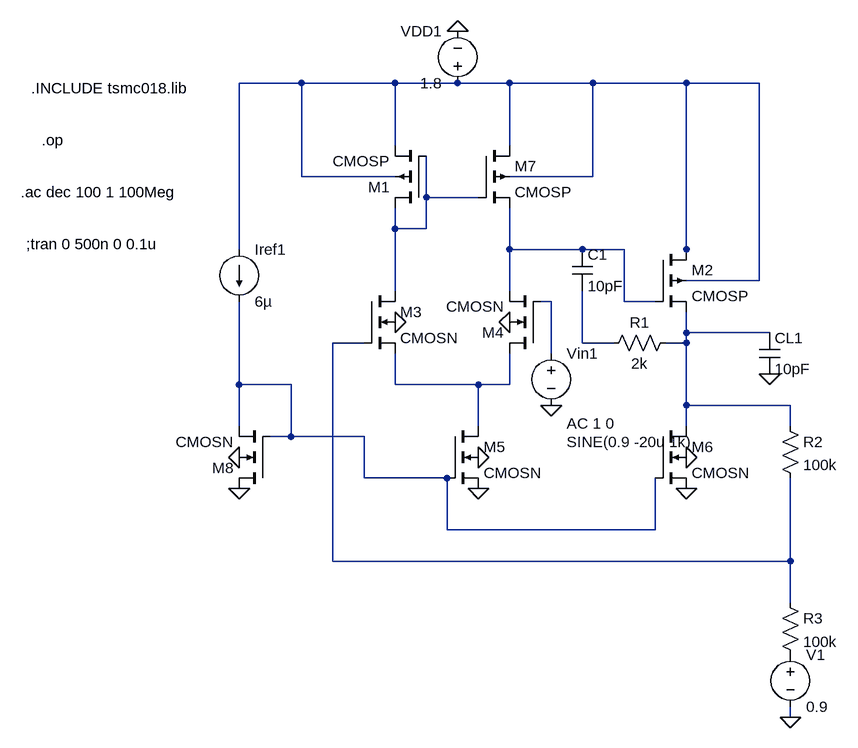
[diagram p0: schematic 2 stage ota closed loop design for dc gain 2.asc]
2 stage ota closed loop design for dc gain 2.asc, the LTspice schematic file:
Version 4
SHEET 1 880 680
WIRE -640 -800 -736 -800
WIRE -496 -800 -640 -800
WIRE -400 -800 -496 -800
WIRE -320 -800 -400 -800
WIRE -192 -800 -320 -800
WIRE -48 -800 -192 -800
WIRE 64 -800 -48 -800
WIRE -496 -704 -496 -800
WIRE -320 -704 -320 -800
WIRE -640 -656 -640 -800
WIRE -496 -656 -640 -656
WIRE -192 -656 -192 -800
WIRE -192 -656 -320 -656
WIRE -448 -624 -448 -688
WIRE -368 -624 -448 -624
WIRE -496 -576 -496 -608
WIRE -448 -576 -448 -624
WIRE -448 -576 -496 -576
WIRE -736 -544 -736 -800
WIRE -320 -544 -320 -608
WIRE -208 -544 -320 -544
WIRE -144 -544 -208 -544
WIRE -48 -544 -48 -800
WIRE -48 -528 -48 -544
WIRE 64 -496 64 -800
WIRE 64 -496 -48 -496
WIRE -496 -480 -496 -576
WIRE -320 -480 -320 -544
WIRE -256 -464 -272 -464
WIRE -144 -464 -144 -544
WIRE -96 -464 -144 -464
WIRE -48 -416 -48 -448
WIRE 80 -416 -48 -416
WIRE -544 -400 -592 -400
WIRE -208 -400 -208 -480
WIRE -160 -400 -208 -400
WIRE -48 -400 -48 -416
WIRE -48 -400 -80 -400
WIRE -256 -384 -256 -464
WIRE -736 -336 -736 -464
WIRE -656 -336 -736 -336
WIRE -496 -336 -496 -384
WIRE -368 -336 -496 -336
WIRE -320 -336 -320 -384
WIRE -320 -336 -368 -336
WIRE -48 -304 -48 -400
WIRE 112 -304 -48 -304
WIRE -736 -272 -736 -336
WIRE -368 -272 -368 -336
WIRE -48 -272 -48 -304
WIRE 112 -272 112 -304
WIRE -656 -256 -656 -336
WIRE -656 -256 -688 -256
WIRE -544 -256 -656 -256
WIRE -544 -192 -544 -256
WIRE -416 -192 -544 -192
WIRE -416 -112 -416 -192
WIRE -96 -112 -96 -192
WIRE -96 -112 -416 -112
WIRE -592 -64 -592 -400
WIRE 112 -64 112 -192
WIRE 112 -64 -592 -64
WIRE 112 0 112 -64
WIRE 112 176 112 160
FLAG -320 -432 0
FLAG -496 -432 0
FLAG -368 -224 0
FLAG -368 -176 0
FLAG -48 -176 0
FLAG -48 -224 0
FLAG -736 -224 0
FLAG 80 -352 0
FLAG -400 -880 0
FLAG -256 -304 0
FLAG -736 -176 0
FLAG 112 176 0
SYMBOL cmosp -448 -608 R180
SYMATTR InstName M1
SYMATTR Value2 l=0.36u w=5.4u
SYMBOL cmosp -96 -544 R0
SYMATTR InstName M2
SYMATTR Value2 l=0.36u w=10.8u
SYMBOL cmosn -544 -480 R0
SYMATTR InstName M3
SYMATTR Value2 l=0.36u w=2.35u
SYMBOL cmosn -272 -384 R180
SYMATTR InstName M4
SYMATTR Value2 l=0.36u w=2.35u
SYMBOL cmosn -416 -272 R0
SYMATTR InstName M5
SYMATTR Value2 l=0.36u w=4.68u
SYMBOL cmosn -96 -272 R0
SYMATTR InstName M6
SYMATTR Value2 l=0.36u w=4.68u
SYMBOL cmosp -368 -704 R0
SYMATTR InstName M7
SYMATTR Value2 l=0.36u w=5.4u
SYMBOL current -736 -544 R0
WINDOW 123 0 0 Left 2
WINDOW 39 0 0 Left 2
SYMATTR InstName Iref1
SYMATTR Value 6µ
SYMBOL cap -224 -544 R0
SYMATTR InstName C1
SYMATTR Value 10pF
SYMBOL res -64 -416 R90
WINDOW 0 0 56 VBottom 2
WINDOW 3 32 56 VTop 2
SYMATTR InstName R1
SYMATTR Value 2k
SYMBOL cmosn -688 -176 R180
SYMATTR InstName M8
SYMATTR Value2 l=0.36u w=0.47u
SYMBOL cap 64 -416 R0
SYMATTR InstName CL1
SYMATTR Value 10pF
SYMBOL voltage -400 -784 R180
WINDOW 0 24 96 Left 2
WINDOW 3 24 16 Left 2
SYMATTR InstName VDD1
SYMATTR Value 1.8
SYMBOL voltage -256 -400 R0
WINDOW 123 24 124 Left 2
WINDOW 39 0 0 Left 2
WINDOW 3 24 152 Left 2
SYMATTR Value2 AC 1 0
SYMATTR Value SINE(0.9 -20u 1k)
SYMATTR InstName Vin1
SYMBOL res 96 -288 R0
SYMATTR InstName R2
SYMATTR Value 100k
SYMBOL res 96 -16 R0
SYMATTR InstName R3
SYMATTR Value 100k
SYMBOL voltage 112 64 R0
SYMATTR InstName V1
SYMATTR Value 0.9
TEXT -1056 -792 Left 2 !.INCLUDE tsmc018.lib
TEXT -1040 -712 Left 2 !.op
TEXT -1072 -632 Left 2 !.ac dec 100 1 100Meg
TEXT -1064 -552 Left 2 !;tran 0 500n 0 0.1u

The netlist it stands for:
* 2 stage ota closed loop design for dc gain 2.asc
M1 N002 N002 N001 N001 CMOSP l=0.36u w=5.4u
M2 N001 N003 N005 N001 CMOSP l=0.36u w=10.8u
M3 N002 N006 N009 0 CMOSN l=0.36u w=2.35u
M4 N009 N004 N003 0 CMOSN l=0.36u w=2.35u
M5 N009 N008 0 0 CMOSN l=0.36u w=4.68u
M6 N005 N008 0 0 CMOSN l=0.36u w=4.68u
M7 N001 N002 N003 N001 CMOSP l=0.36u w=5.4u
Iref1 N001 N008 6µ
C1 N003 N007 10pF
R1 N005 N007 2k
M8 0 N008 N008 0 CMOSN l=0.36u w=0.47u
CL1 N005 0 10pF
VDD1 N001 0 1.8
Vin1 N004 0 SINE(0.9 -20u 1k) AC 1 0
R2 N005 N006 100k
R3 N006 P001 100k
V1 P001 0 0.9
.model NMOS NMOS
.model PMOS PMOS
.lib standard.mos
.INCLUDE tsmc018.lib
.op
.ac dec 100 1 100Meg
;tran 0 500n 0 0.1u
.backanno
.end